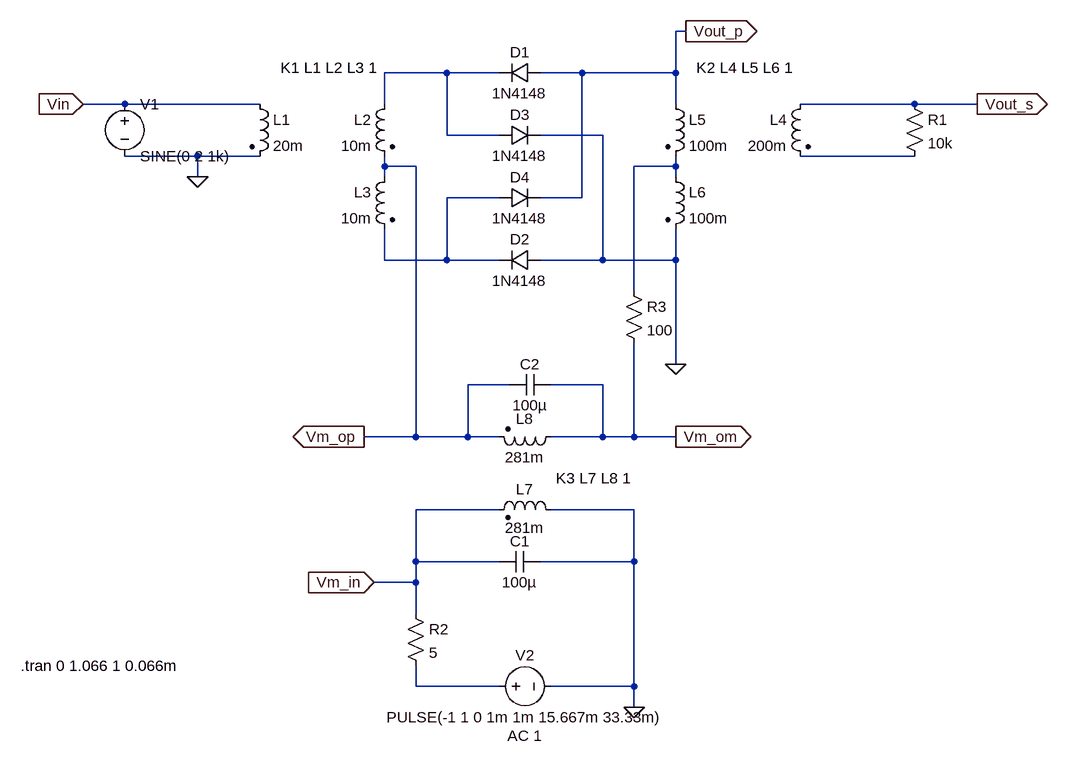
[diagram p0: schematic Voice Changer with Square Wave.asc]
Voice Changer with Square Wave.asc, the LTspice schematic file:
Version 4
SHEET 1 1312 1132
WIRE 720 32 704 32
WIRE 352 96 256 96
WIRE 432 96 352 96
WIRE 560 96 496 96
WIRE 704 96 704 32
WIRE 704 96 560 96
WIRE -144 144 -208 144
WIRE 64 144 -144 144
WIRE 256 144 256 96
WIRE 704 144 704 96
WIRE 1072 144 896 144
WIRE 1168 144 1072 144
WIRE 352 192 352 96
WIRE 432 192 352 192
WIRE 592 192 496 192
WIRE -32 224 -144 224
WIRE 64 224 -32 224
WIRE 1072 224 896 224
WIRE 256 240 256 224
WIRE 304 240 256 240
WIRE 704 240 704 224
WIRE 704 240 640 240
WIRE -32 256 -32 224
WIRE 256 256 256 240
WIRE 704 256 704 240
WIRE 432 288 352 288
WIRE 560 288 560 96
WIRE 560 288 496 288
WIRE 256 384 256 336
WIRE 352 384 352 288
WIRE 352 384 256 384
WIRE 432 384 352 384
WIRE 592 384 592 192
WIRE 592 384 496 384
WIRE 704 384 704 336
WIRE 704 384 592 384
WIRE 640 432 640 240
WIRE 704 544 704 384
WIRE 448 576 384 576
WIRE 592 576 512 576
WIRE 304 656 304 240
WIRE 304 656 224 656
WIRE 384 656 384 576
WIRE 384 656 304 656
WIRE 432 656 384 656
WIRE 592 656 592 576
WIRE 592 656 512 656
WIRE 640 656 640 512
WIRE 640 656 592 656
WIRE 704 656 640 656
WIRE 432 768 304 768
WIRE 640 768 512 768
WIRE 304 848 304 768
WIRE 432 848 304 848
WIRE 640 848 640 768
WIRE 640 848 496 848
WIRE 304 880 304 848
WIRE 304 880 240 880
WIRE 304 928 304 880
WIRE 304 1040 304 1008
WIRE 432 1040 304 1040
WIRE 640 1040 640 848
WIRE 640 1040 512 1040
WIRE 640 1072 640 1040
FLAG 640 1072 0
FLAG -32 256 0
FLAG -208 144 Vin
IOPIN -208 144 In
FLAG 1168 144 Vout_s
IOPIN 1168 144 Out
FLAG 240 880 Vm_in
IOPIN 240 880 In
FLAG 704 656 Vm_om
IOPIN 704 656 Out
FLAG 224 656 Vm_op
IOPIN 224 656 Out
FLAG 704 544 0
FLAG 720 32 Vout_p
IOPIN 720 32 Out
SYMBOL ind2 48 128 R0
SYMATTR InstName L1
SYMATTR Value 20m
SYMATTR SpiceLine Rser=5
SYMBOL ind2 272 128 M0
SYMATTR InstName L2
SYMATTR Value 10m
SYMATTR SpiceLine Rser=5
SYMBOL ind2 528 640 R90
WINDOW 0 4 56 VBottom 2
WINDOW 3 32 56 VTop 2
SYMATTR InstName L8
SYMATTR Value 281m
SYMATTR Type ind
SYMATTR SpiceLine Rser=5
SYMBOL ind2 528 784 M270
WINDOW 0 32 56 VTop 2
WINDOW 3 4 56 VBottom 2
SYMATTR InstName L7
SYMATTR Value 281m
SYMATTR Type ind
SYMATTR SpiceLine Rser=100
SYMBOL ind2 272 240 M0
SYMATTR InstName L3
SYMATTR Value 10m
SYMATTR SpiceLine Rser=5
SYMBOL ind2 912 128 M0
SYMATTR InstName L4
SYMATTR Value 200m
SYMATTR SpiceLine Rser=8
SYMBOL ind2 688 128 R0
SYMATTR InstName L5
SYMATTR Value 100m
SYMATTR SpiceLine Rser=5
SYMBOL ind2 688 240 R0
SYMATTR InstName L6
SYMATTR Value 100m
SYMATTR SpiceLine Rser=5
SYMBOL diode 496 80 R90
WINDOW 0 0 32 VBottom 2
WINDOW 3 32 32 VTop 2
SYMATTR InstName D1
SYMATTR Value 1N4148
SYMBOL diode 496 368 R90
WINDOW 0 0 32 VBottom 2
WINDOW 3 32 32 VTop 2
SYMATTR InstName D2
SYMATTR Value 1N4148
SYMBOL diode 432 208 R270
WINDOW 0 32 32 VTop 2
WINDOW 3 0 32 VBottom 2
SYMATTR InstName D3
SYMATTR Value 1N4148
SYMBOL diode 432 304 R270
WINDOW 0 32 32 VTop 2
WINDOW 3 0 32 VBottom 2
SYMATTR InstName D4
SYMATTR Value 1N4148
SYMBOL res 1056 128 R0
SYMATTR InstName R1
SYMATTR Value 10k
SYMBOL voltage -144 128 R0
WINDOW 123 24 124 Left 2
WINDOW 39 24 152 Left 2
SYMATTR InstName V1
SYMATTR Value SINE(0 2 1k)
SYMBOL res 288 912 R0
SYMATTR InstName R2
SYMATTR Value 5
SYMBOL res 624 416 R0
SYMATTR InstName R3
SYMATTR Value 100
SYMBOL cap 496 832 R90
WINDOW 0 0 32 VBottom 2
WINDOW 3 32 32 VTop 2
SYMATTR InstName C1
SYMATTR Value 100µ
SYMBOL voltage 416 1040 R270
WINDOW 0 32 56 VTop 2
WINDOW 3 -32 56 VBottom 2
WINDOW 123 -60 56 VBottom 2
WINDOW 39 0 0 Left 0
SYMATTR InstName V2
SYMATTR Value PULSE(-1 1 0 1m 1m 15.667m 33.33m)
SYMATTR Value2 AC 1
SYMBOL cap 512 560 R90
WINDOW 0 0 32 VBottom 2
WINDOW 3 32 32 VTop 2
SYMATTR InstName C2
SYMATTR Value 100µ
TEXT 520 720 Left 2 !K3 L7 L8 1
TEXT 96 88 Left 2 !K1 L1 L2 L3 1
TEXT 736 88 Left 2 !K2 L4 L5 L6 1
TEXT -304 1008 Left 2 !.tran 0 1.066 1 0.066m

The netlist it stands for:
* Voice Changer with Square Wave.asc
L1 Vin 0 20m Rser=5
L2 N001 Vm_op 10m Rser=5
L8 Vm_om Vm_op 281m Rser=5
L7 0 Vm_in 281m Rser=100
L3 Vm_op N004 10m Rser=5
L4 Vout_s N002 200m Rser=8
L5 Vout_p N003 100m Rser=5
L6 N003 0 100m Rser=5
D1 Vout_p N001 1N4148
D2 0 N004 1N4148
D3 N001 0 1N4148
D4 N004 Vout_p 1N4148
R1 Vout_s N002 10k
V1 Vin 0 SINE(0 2 1k)
R2 Vm_in N005 5
R3 N003 Vm_om 100
C1 0 Vm_in 100µ
V2 N005 0 PULSE(-1 1 0 1m 1m 15.667m 33.33m) AC 1
C2 Vm_om Vm_op 100µ
.model D D
.lib standard.dio
K3 L7 L8 1
K1 L1 L2 L3 1
K2 L4 L5 L6 1
.tran 0 1.066 1 0.066m
.backanno
.end